# EAGLE schematic Test_sch (EAGLE 9.2.2)
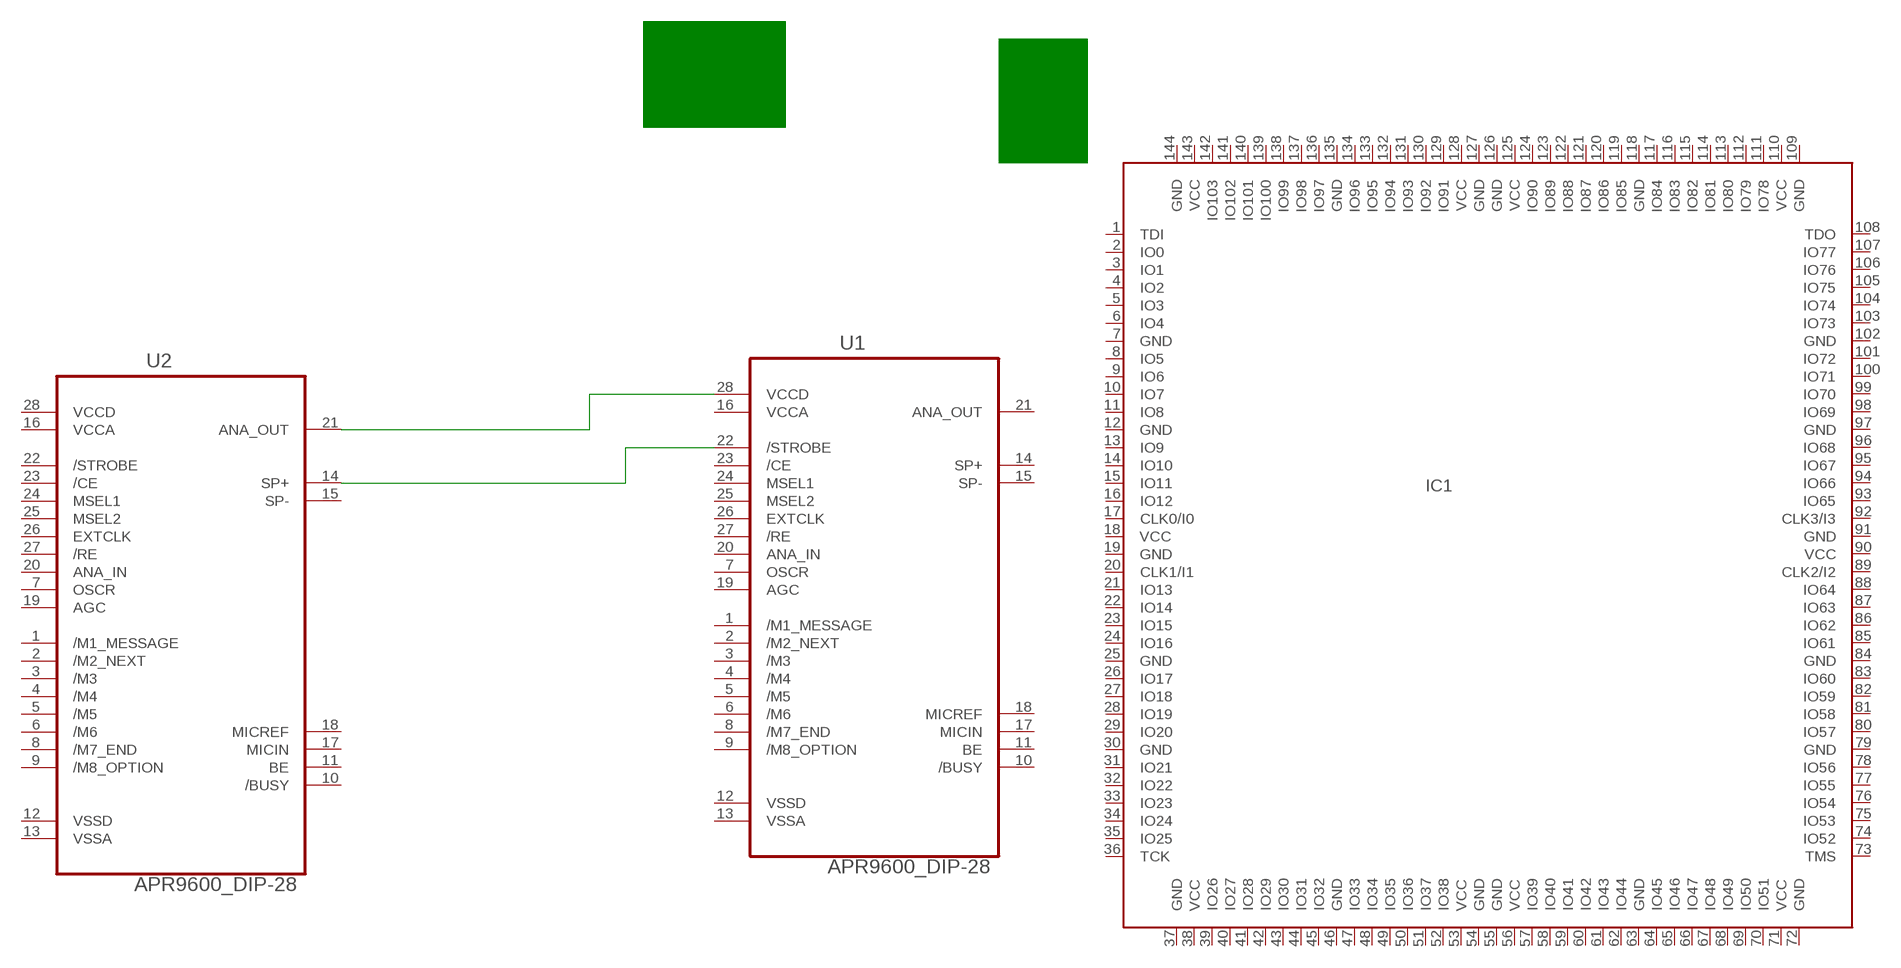
[diagram p0: schematic, sheet 1]

## Parts
IC1  M5-P144  [PQFP144]
U1  APR9600_DIP-28  [DIP254P1525X550-28P]
U2  APR9600_DIP-28  [DIP254P1525X550-28P]

## Nets
N$1: U1.28(VCCD) U2.21(ANA_OUT)
N$2: U1.22(/STROBE) U2.14(SP+)
Unconnected: IC1.1(TDI) IC1.2(IO0) IC1.3(IO1) IC1.4(IO2) IC1.5(IO3) IC1.6(IO4) IC1.8(IO5) IC1.9(IO6) IC1.10(IO7) IC1.11(IO8) IC1.13(IO9) IC1.14(IO10) IC1.15(IO11) IC1.16(IO12) IC1.17(CLK0/I0) IC1.20(CLK1/I1) IC1.21(IO13) IC1.22(IO14) IC1.23(IO15) IC1.24(IO16) IC1.26(IO17) IC1.27(IO18) IC1.28(IO19) IC1.29(IO20) IC1.31(IO21) IC1.32(IO22) IC1.33(IO23) IC1.34(IO24) IC1.35(IO25) IC1.36(TCK) IC1.39(IO26) IC1.40(IO27) IC1.41(IO28) IC1.42(IO29) IC1.43(IO30) IC1.44(IO31) IC1.45(IO32) IC1.47(IO33) IC1.48(IO34) IC1.49(IO35) IC1.50(IO36) IC1.51(IO37) IC1.52(IO38) IC1.57(IO39) IC1.58(IO40) IC1.59(IO41) IC1.60(IO42) IC1.61(IO43) IC1.62(IO44) IC1.64(IO45) IC1.65(IO46) IC1.66(IO47) IC1.67(IO48) IC1.68(IO49) IC1.69(IO50) IC1.70(IO51) IC1.73(TMS) IC1.74(IO52) IC1.75(IO53) IC1.76(IO54) IC1.77(IO55) IC1.78(IO56) IC1.80(IO57) IC1.81(IO58) IC1.82(IO59) IC1.83(IO60) IC1.85(IO61) IC1.86(IO62) IC1.87(IO63) IC1.88(IO64) IC1.89(CLK2/I2) IC1.92(CLK3/I3) IC1.93(IO65) IC1.94(IO66) IC1.95(IO67) IC1.96(IO68) IC1.98(IO69) IC1.99(IO70) IC1.100(IO71) IC1.101(IO72) IC1.103(IO73) IC1.104(IO74) IC1.105(IO75) IC1.106(IO76) IC1.107(IO77) IC1.108(TDO) IC1.111(IO78) IC1.112(IO79) IC1.113(IO80) IC1.114(IO81) IC1.115(IO82) IC1.116(IO83) IC1.117(IO84) IC1.119(IO85) IC1.120(IO86) IC1.121(IO87) IC1.122(IO88) IC1.123(IO89) IC1.124(IO90) IC1.129(IO91) IC1.130(IO92) IC1.131(IO93) IC1.132(IO94) IC1.133(IO95) IC1.134(IO96) IC1.136(IO97) IC1.137(IO98) IC1.138(IO99) IC1.139(IO100) IC1.140(IO101) IC1.141(IO102) IC1.142(IO103) U1.1(/M1_MESSAGE) U1.2(/M2_NEXT) U1.3(/M3) U1.4(/M4) U1.5(/M5) U1.6(/M6) U1.7(OSCR) U1.8(/M7_END) U1.9(/M8_OPTION) U1.10(/BUSY) U1.11(BE) U1.12(VSSD) U1.13(VSSA) U1.14(SP+) U1.15(SP-) U1.17(MICIN) U1.18(MICREF) U1.19(AGC) U1.20(ANA_IN) U1.21(ANA_OUT) U1.23(/CE) U1.24(MSEL1) U1.25(MSEL2) U1.26(EXTCLK) U1.27(/RE) U2.1(/M1_MESSAGE) U2.2(/M2_NEXT) U2.3(/M3) U2.4(/M4) U2.5(/M5) U2.6(/M6) U2.7(OSCR) U2.8(/M7_END) U2.9(/M8_OPTION) U2.10(/BUSY) U2.11(BE) U2.12(VSSD) U2.13(VSSA) U2.15(SP-) U2.17(MICIN) U2.18(MICREF) U2.19(AGC) U2.20(ANA_IN) U2.22(/STROBE) U2.23(/CE) U2.24(MSEL1) U2.25(MSEL2) U2.26(EXTCLK) U2.27(/RE)

## Power pins joined to a net without a drawn wire
GND: IC1.7(GND) IC1.12(GND) IC1.19(GND) IC1.25(GND) IC1.30(GND) IC1.37(GND) IC1.46(GND) IC1.54(GND) IC1.55(GND) IC1.63(GND) IC1.72(GND) IC1.79(GND) IC1.84(GND) IC1.91(GND) IC1.97(GND) IC1.102(GND) IC1.109(GND) IC1.118(GND) IC1.126(GND) IC1.127(GND) IC1.135(GND) IC1.144(GND)
VCC: IC1.18(VCC) IC1.38(VCC) IC1.53(VCC) IC1.56(VCC) IC1.71(VCC) IC1.90(VCC) IC1.110(VCC) IC1.125(VCC) IC1.128(VCC) IC1.143(VCC)
VCCA: U1.16(VCCA) U2.16(VCCA)
VCCD: U2.28(VCCD)

## Library data of the parts
IC1 = amd-mach:M5-P144: AMD MACH SERIES; OC_FARNELL: unknown; OC_NEWARK: unknown
U1 U2 = aplus:APR9600_DIP-28: SINGLE-CHIP VOICE RECORDING & PLAYBACK DEVICE FOR SINGLE 60 SECOND # Created by SCRIPT exported from Ultra Librarian Gold 5.3.88 Copyright © 1999-2010 # Tanvir Mohammed, Premier Farnell 2013-04-24 alf@cadsoft.de; MPN: APR9600_DIP-28; OC_FARNELL: unknown; OC_NEWARK: unknown; PACKAGE: DIP-28; SUPPLIER: APLUS INTEGRATED CIRCUITS INC